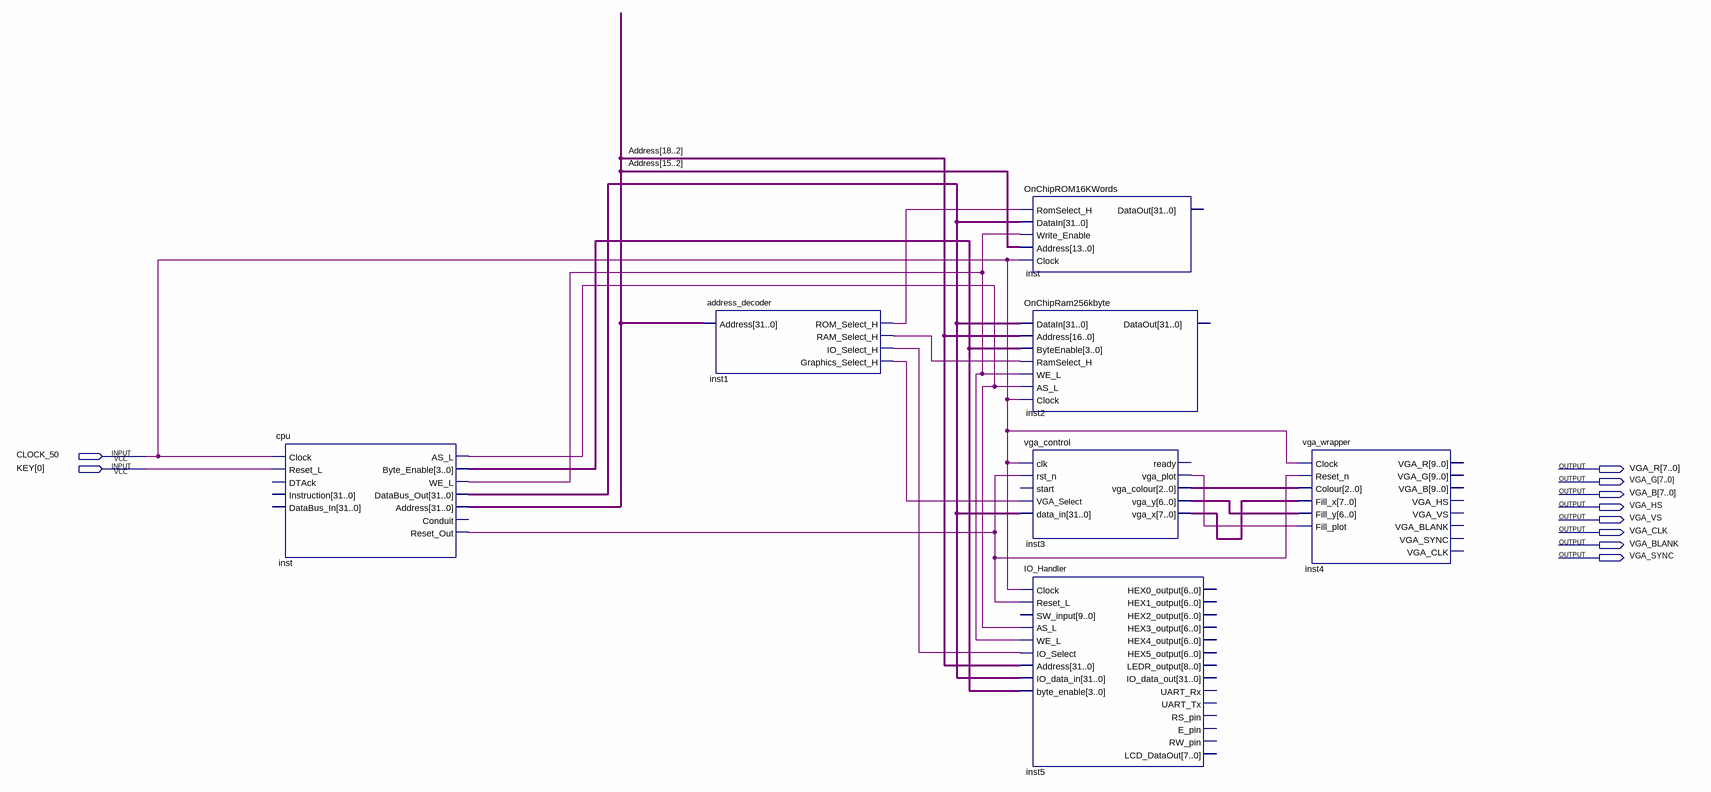
[diagram p0: schematic sheet]
// Quartus schematic risc_v_core.bdf as structural Verilog: 7 symbols, 10 pins
module risc_v_core (
  input  CLOCK_50,
  input  [0:0] KEY,
  output [7:0] VGA_R,
  output [7:0] VGA_G,
  output [7:0] VGA_B,
  output VGA_HS,
  output VGA_VS,
  output VGA_CLK,
  output VGA_BLANK,
  output VGA_SYNC
);

  wire inst1_graphics_select_h, inst1_io_select_h, inst1_ram_select_h, inst1_rom_select_h, inst3_vga_plot,
       inst_as_l, inst_reset_out, inst_we_l;
  wire [2:0] inst3_vga_colour;
  wire [3:0] inst_byte_enable;
  wire [6:0] inst3_vga_y;
  wire [7:0] inst3_vga_x;
  wire [18:2] Address;
  wire [31:0] inst_databus_out;

  cpu inst (
    .Clock(CLOCK_50), .Reset_L(KEY[0]), .AS_L(inst_as_l), .Byte_Enable(inst_byte_enable), .WE_L(inst_we_l),
    .DataBus_Out(inst_databus_out), .Address(Address), .Reset_Out(inst_reset_out));  // open: DTAck, Instruction, DataBus_In, Conduit
  address_decoder inst1 (
    .Address(Address), .ROM_Select_H(inst1_rom_select_h), .RAM_Select_H(inst1_ram_select_h),
    .IO_Select_H(inst1_io_select_h), .Graphics_Select_H(inst1_graphics_select_h));
  OnChipROM16KWords inst_dup2 (
    .RomSelect_H(inst1_rom_select_h), .DataIn(inst_databus_out), .Write_Enable(inst_we_l),
    .Address(Address[15:2]), .Clock(CLOCK_50));  // open: DataOut
  OnChipRam256kbyte inst2 (
    .DataIn(inst_databus_out), .Address(Address), .ByteEnable(inst_byte_enable),
    .RamSelect_H(inst1_ram_select_h), .WE_L(inst_we_l), .AS_L(inst_as_l), .Clock(CLOCK_50));  // open: DataOut
  vga_control inst3 (
    .clk(CLOCK_50), .rst_n(inst_reset_out), .VGA_Select(inst1_graphics_select_h), .data_in(inst_databus_out),
    .vga_plot(inst3_vga_plot), .vga_colour(inst3_vga_colour), .vga_y(inst3_vga_y), .vga_x(inst3_vga_x));  // open: start, ready
  IO_Handler inst5 (
    .Clock(CLOCK_50), .Reset_L(inst_reset_out), .AS_L(inst_as_l), .WE_L(inst_we_l),
    .IO_Select(inst1_io_select_h), .Address(Address), .IO_data_in(inst_databus_out),
    .byte_enable(inst_byte_enable));  // open: SW_input, HEX0_output, HEX1_output, HEX2_output, HEX3_output, HEX4_output, HEX5_output, LEDR_output, IO_data_out, UART_Rx, UART_Tx, RS_pin, E_pin, RW_pin, LCD_DataOut
  vga_wrapper inst4 (
    .Clock(CLOCK_50), .Reset_n(inst_reset_out), .Colour(inst3_vga_colour), .Fill_x(inst3_vga_x),
    .Fill_y(inst3_vga_y), .Fill_plot(inst3_vga_plot));  // open: VGA_R, VGA_G, VGA_B, VGA_HS, VGA_VS, VGA_BLANK, VGA_SYNC, VGA_CLK
endmodule
